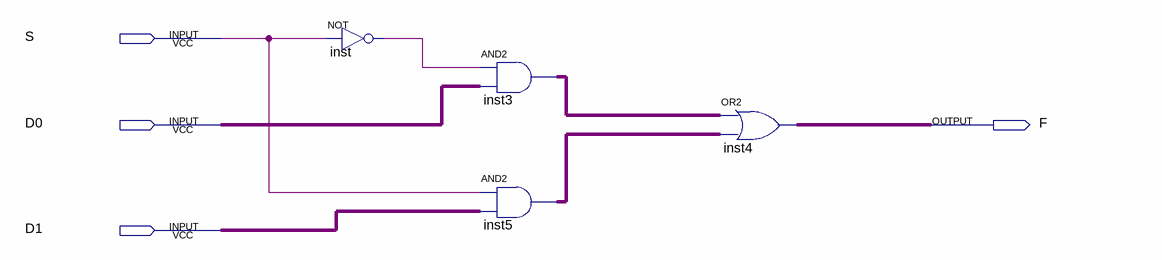
[diagram p0: schematic sheet]
// Quartus schematic mx.bdf as structural Verilog: 4 symbols, 4 pins
module mx (
  input  S,
  input  D0,
  input  D1,
  output F
);

  wire inst3_out, inst5_out, inst_out;

  not inst (inst_out, S);
  and inst3 (inst3_out, inst_out, D0);
  and inst5 (inst5_out, S, D1);
  or inst4 (F, inst3_out, inst5_out);
endmodule
